# Altium schematic sheet ch32v307_core_board.SchDoc
size B
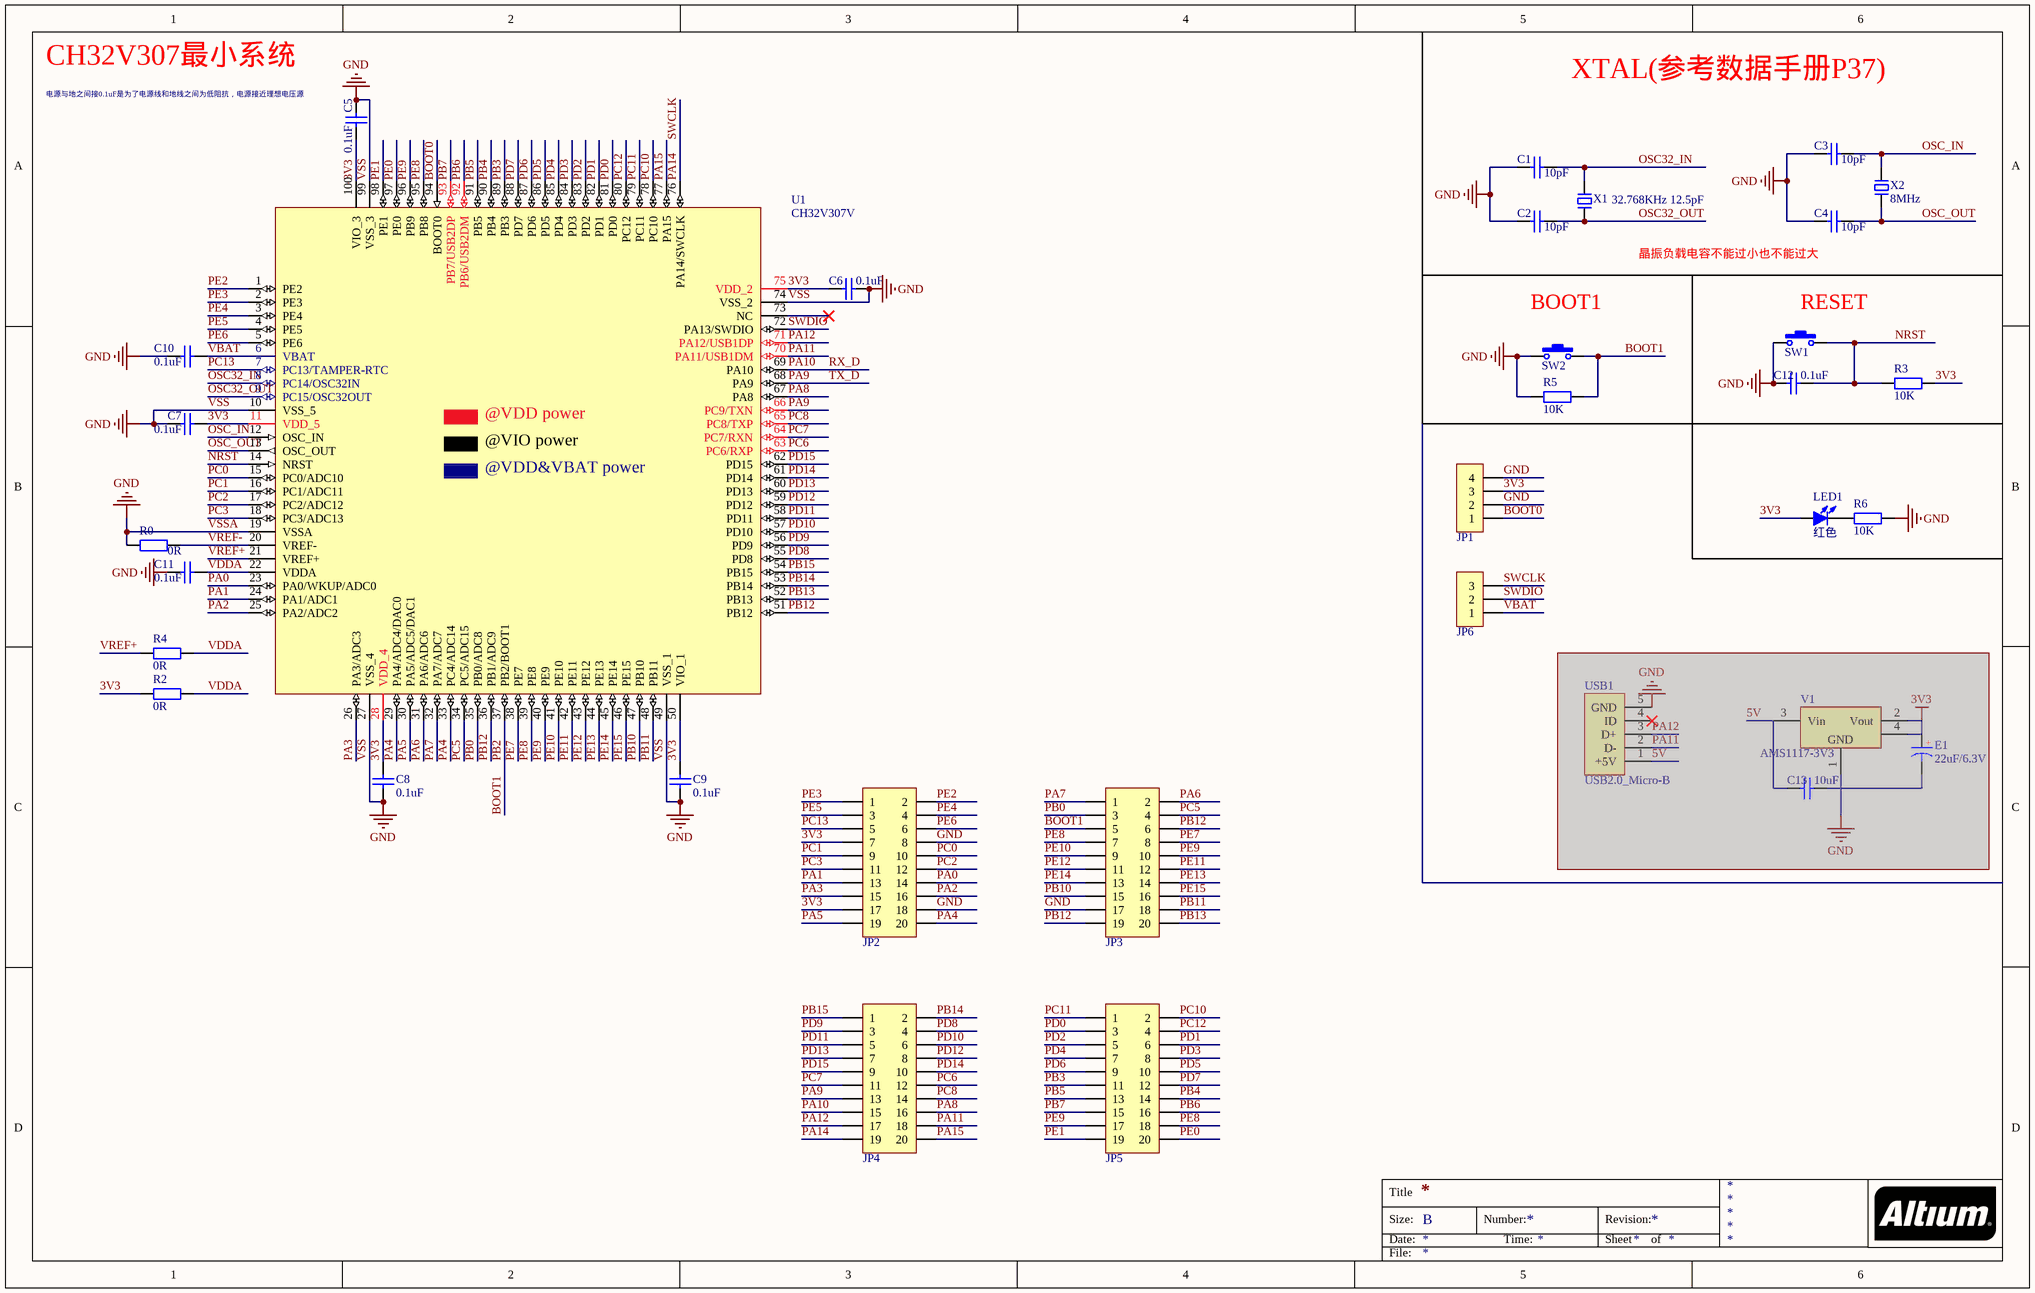
[diagram p0: ch32v307_core_board.SchDoc]

## Parts
C1  10pF  [C0805_L]
C2  10pF  [C0805_L]
C3  10pF  [C0805_L]
C4  10pF  [C0805_L]
C5  0.1uF  [C0805_L]
C6  0.1uF  [C0805_L]
C7  0.1uF  [C0805_L]
C8  0.1uF  [C0805_L]
C9  0.1uF  [C0805_L]
C10  0.1uF  [C0805_L]
C11  0.1uF  [C0805_L]
C12  0.1uF  [C0805_L]
C13  10uF  [C0805_L]  (masked out: inside a compile mask, not in the netlist)
E1  22uF/6.3V  [C_3216]  (masked out: inside a compile mask, not in the netlist)
JP1  HDR-1X4  [HDR2.54-LI-4P]  (value not drawn)
JP2  Header 2X10  [HDR2.54-LI-2x10P]  (value not drawn)
JP3  Header 2X10  [HDR2.54-LI-2x10P]  (value not drawn)
JP4  Header 2X10  [HDR2.54-LI-2x10P]  (value not drawn)
JP5  Header 2X10  [HDR2.54-LI-2x10P]  (value not drawn)
JP6  HDR-1X3  [HDR2.54-LI-3P]  (value not drawn)
LED1  红色  [LED0805_G]
R0  0R  [R0805_L]
R2  0R  [R0805_L]
R3  10K  [R0805_L]
R4  0R  [R0805_L]
R5  10K  [R0805_L]
R6  10K  [R0805_L]
SW1  3x6x5  [SW SMD-3*6*4.3]  (value not drawn)
SW2  3x6x5  [SW SMD-3*6*4.3]  (value not drawn)
U1  CH32V307V  [LQFP100]
USB1  USB2.0_Micro-B  [USB2.0_MICRO-B_1]  (masked out: inside a compile mask, not in the netlist)
V1  AMS1117-3V3  [SOT223_L]  (masked out: inside a compile mask, not in the netlist)
X1  32.768KHz 12.5pF  [XTAL-3215-2P]
X2  8MHz  [XTAL-5032-2P]

## Nets
GND: C1.1 C2.1 C3.1 C4.1 C5.2 C6.2 C7.2 C8.2 C9.2 C10.2 C11.2 C12.1 JP1.2 JP1.4 JP2.8 JP2.18 JP3.17 R0.1 R5.1 R6.2 SW1.1 SW2.1 U1.10(VSS_5) U1.19(VSSA) U1.27(VSS_4) U1.49(VSS_1) U1.74(VSS_2) U1.99(VSS_3)  [also labelled VSS, VSSA]
3V3: C5.1 C6.1 C7.1 C8.1 C9.1 JP1.3 JP2.7 JP2.17 LED1.1(A) R2.1 R3.2 U1.11(VDD_5) U1.28(VDD_4) U1.50(VIO_1) U1.75(VDD_2) U1.100(VIO_3)
BOOT0: JP1.1 U1.94(BOOT0)
BOOT1: JP3.5 R5.2 SW2.2 U1.37(PB2/BOOT1)  [also labelled PB2]
NRST: C12.2 R3.1 SW1.2 U1.14(NRST)
OSC32_IN: C1.2 U1.8(PC14/OSC32IN) X1.2
OSC32_OUT: C2.2 U1.9(PC15/OSC32OUT) X1.1
OSC_IN: C3.2 U1.12(OSC_IN) X2.2
OSC_OUT: C4.2 U1.13(OSC_OUT) X2.1
PA0: JP2.14 U1.23(PA0/WKUP/ADC0)
PA1: JP2.13 U1.24(PA1/ADC1)
PA2: JP2.16 U1.25(PA2/ADC2)
PA3: JP2.15 U1.26(PA3/ADC3)
PA4: JP2.20 U1.29(PA4/ADC4/DAC0) U1.33(PC4/ADC14)
PA5: JP2.19 U1.30(PA5/ADC5/DAC1)
PA6: JP3.2 U1.31(PA6/ADC6)
PA7: JP3.1 U1.32(PA7/ADC7)
PA8: JP4.16 U1.67(PA8)
PA9: JP4.13 U1.66(PC9/TXN) U1.68(PA9)  [also labelled TX_D]
PA10: JP4.15 U1.69(PA10)  [also labelled RX_D]
PA11: JP4.18 U1.70(PA11/USB1DM)
PA12: JP4.17 U1.71(PA12/USB1DP)
PA14: JP4.19 JP6.3 U1.76(PA14/SWCLK)  [also labelled SWCLK]
PA15: JP4.20 U1.77(PA15)
PB0: JP3.3 U1.35(PB0/ADC8)
PB3: JP5.11 U1.89(PB3)
PB4: JP5.14 U1.90(PB4)
PB5: JP5.13 U1.91(PB5)
PB6: JP5.16 U1.92(PB6/USB2DM)
PB7: JP5.15 U1.93(PB7/USB2DP)
PB10: JP3.15 U1.47(PB10)
PB11: JP3.18 U1.48(PB11)
PB12: JP3.6 JP3.19 U1.36(PB1/ADC9) U1.51(PB12)
PB13: JP3.20 U1.52(PB13)
PB14: JP4.2 U1.53(PB14)
PB15: JP4.1 U1.54(PB15)
PC0: JP2.10 U1.15(PC0/ADC10)
PC1: JP2.9 U1.16(PC1/ADC11)
PC2: JP2.12 U1.17(PC2/ADC12)
PC3: JP2.11 U1.18(PC3/ADC13)
PC5: JP3.4 U1.34(PC5/ADC15)
PC6: JP4.12 U1.63(PC6/RXP)
PC7: JP4.11 U1.64(PC7/RXN)
PC8: JP4.14 U1.65(PC8/TXP)
PC10: JP5.2 U1.78(PC10)
PC11: JP5.1 U1.79(PC11)
PC12: JP5.4 U1.80(PC12)
PC13: JP2.5 U1.7(PC13/TAMPER-RTC)
PD0: JP5.3 U1.81(PD0)
PD1: JP5.6 U1.82(PD1)
PD2: JP5.5 U1.83(PD2)
PD3: JP5.8 U1.84(PD3)
PD4: JP5.7 U1.85(PD4)
PD5: JP5.10 U1.86(PD5)
PD6: JP5.9 U1.87(PD6)
PD7: JP5.12 U1.88(PD7)
PD8: JP4.4 U1.55(PD8)
PD9: JP4.3 U1.56(PD9)
PD10: JP4.6 U1.57(PD10)
PD11: JP4.5 U1.58(PD11)
PD12: JP4.8 U1.59(PD12)
PD13: JP4.7 U1.60(PD13)
PD14: JP4.10 U1.61(PD14)
PD15: JP4.9 U1.62(PD15)
PE0: JP5.20 U1.97(PE0)
PE1: JP5.19 U1.98(PE1)
PE2: JP2.2 U1.1(PE2)
PE3: JP2.1 U1.2(PE3)
PE4: JP2.4 U1.3(PE4)
PE5: JP2.3 U1.4(PE5)
PE6: JP2.6 U1.5(PE6)
PE7: JP3.8 U1.38(PE7)
PE8: JP3.7 JP5.18 U1.39(PE8) U1.95(PB8)
PE9: JP3.10 JP5.17 U1.40(PE9) U1.96(PB9)
PE10: JP3.9 U1.41(PE10)
PE11: JP3.12 U1.42(PE11)
PE12: JP3.11 U1.43(PE12)
PE13: JP3.14 U1.44(PE13)
PE14: JP3.13 U1.45(PE14)
PE15: JP3.16 U1.46(PE15)
SWDIO: JP6.2 U1.72(PA13/SWDIO)
VBAT: C10.1 JP6.1 U1.6(VBAT)
VDDA: C11.1 R2.2 R4.2 U1.22(VDDA)
VREF+: R4.1 U1.21(VREF+)
VREF-: R0.2 U1.20(VREF-)
NetLED1_2: LED1.2(K) R6.1

Not connected (* = marked no-connect by the designer): U1 73(NC)*

## Notes on the sheet
- CH32V307最小系统
- 电源与地之间接0.1uF是为了电源线和地线之间为低阻抗，电源接近理想电压源
- XTAL(参考数据手册P37)
- 晶振负载电容不能过小也不能过大
- (near SW2) BOOT1
- (near SW1) RESET
- Title
- Size:
- Date:
- B
- Number:
- Time:
- Revision:
- Sheet
- of
- File:
- (in symbol CH32V307V) @VDD power; @VIO power; @VDD&VBAT power
- (in symbol CT) +

## Library data of the parts
C1-C13 = C: 贴片电容/MLCC电容; BOM名称: 无极性贴片电容; 联系卖家，免费查找封装: 唯一出售店铺网址https://shop463601444.taobao.com
E1 = CT: 贴片钽电容; 联系卖家，免费查找封装: 唯一出售店铺网址https://shop463601444.taobao.com; BOM名称: 贴片钽电容
JP1 = Header 4: 4P接插件; 联系卖家，免费查找封装: 唯一出售店铺网址https://shop463601444.taobao.com; 封装库来自淘宝卖家ID:黄晶宝石: 其他店铺购入均为盗版假冒封装库，请立即申请退款，本店现金奖励20~200元; BOM名称: 4P接插件
JP2-JP5 = Header 10X2: 10*2P接插件; 联系卖家，免费查找封装: 唯一出售店铺网址https://shop463601444.taobao.com; 封装库来自淘宝卖家ID:黄晶宝石: 其他店铺购入均为盗版假冒封装库，请立即申请退款，本店现金奖励20~200元; BOM名称: 10*2P接插件
JP6 = Header 3: 3P接插件; 联系卖家，免费查找封装: 唯一出售店铺网址https://shop463601444.taobao.com; 封装库来自淘宝卖家ID:黄晶宝石: 其他店铺购入均为盗版假冒封装库，请立即申请退款，本店现金奖励20~200元; BOM名称: 3P接插件
LED1 = LED-SMD: 贴片LED; 封装库来自淘宝卖家ID：黄晶宝石: 其他店铺购入均为盗版封装库，请立即申请退款，本店现金奖励20~200元; BOM名称: 贴片LED
R0 R2-R6 = R: 贴片电阻; 联系卖家，免费查找封装: 唯一出售店铺网址https://shop463601444.taobao.com; BOM名称: 贴片电阻
SW1 SW2 = SW-PB: 微动开关; BOM名称: 3x6轻触开关; 联系卖家，免费查找封装: 唯一出售店铺网址https://shop463601444.taobao.com; 封装库来自淘宝卖家ID：黄晶宝石: 其他店铺购入的，请立即申请退款，本店现金奖励20~500元
U1 = CH32V307V: RISC-V FPU HD-MCU, 144MHz, USB_480M, USB OTG, 1000M Ethernet MAC, 2*CAN, FSMC+DVP
USB1 = USB2.0_Micro-B: USB2.0_Micro-B母座; 联系卖家 免费技术支持: 封装库来自淘宝卖家ID：黄晶宝石; BOM名称: USB2.0_Micro-B母座
V1 = AMS1117: 三端稳压芯片; BOM名称: 稳压芯片; 封装库来自淘宝卖家ID：黄晶宝石: 其他店铺购入的买家，请立即申请退款，本店现金奖励20~1000元
X1 X2 = XTAL-2P: 2脚无源晶振(谐振器）; 联系卖家，免费查找封装: 唯一出售店铺网址https://shop463601444.taobao.com; BOM名称: 2脚无源晶振(谐振器）